# EAGLE schematic dynavo-amp (EAGLE 7.4.0)

## Sheet 1 of 2
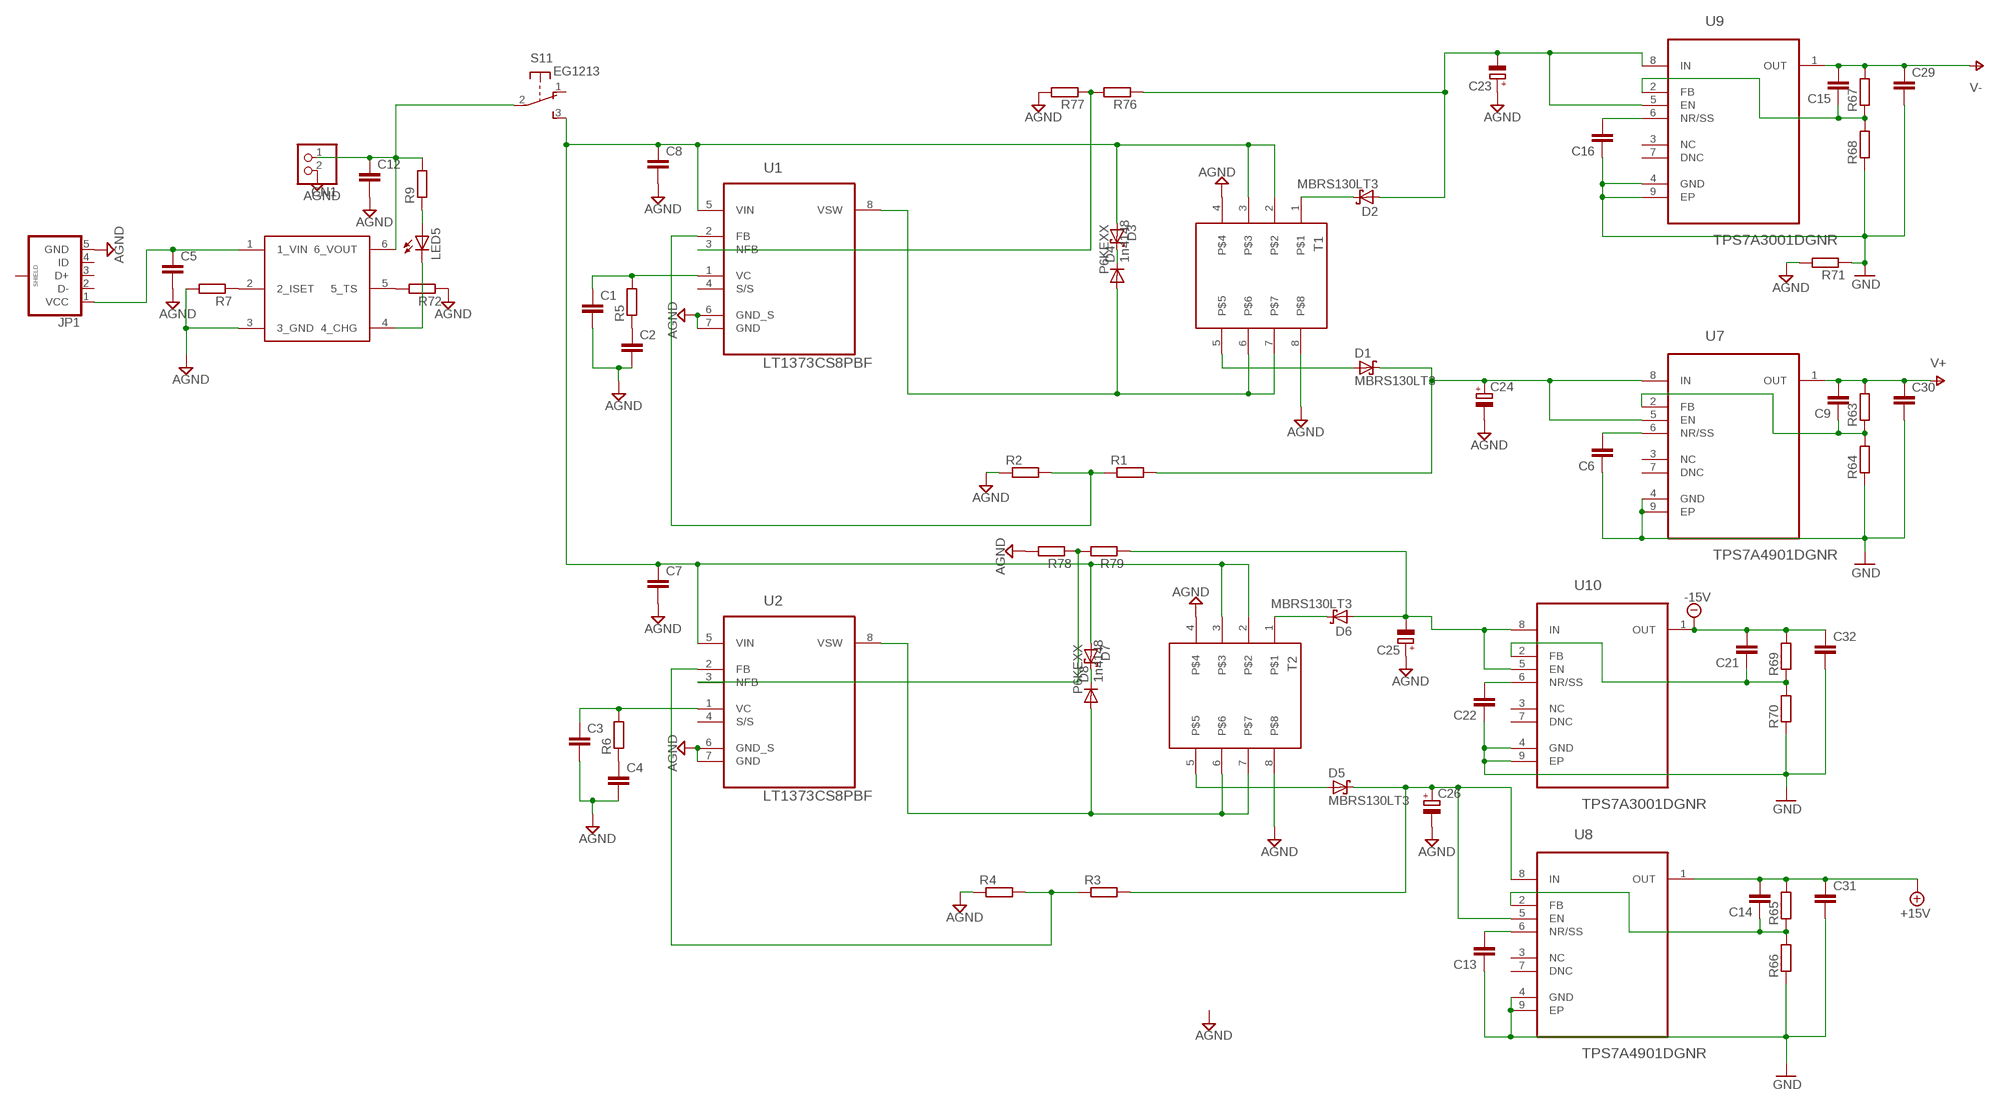
[diagram p0: schematic, sheet 1]

### Parts
C1  C-EUC1210  [C1210]
C2  C-EUC1210  [C1210]
C3  C-EUC1210  [C1210]
C4  C-EUC1210  [C1210]
C5  C-EUC1210  [C1210]
C6  C-EUC1206  [C1206]
C7  C-EUC1210  [C1210]
C8  C-EUC1210  [C1210]
C9  C-EUC1206  [C1206]
C12  C-EUC1210  [C1210]
C13  C-EUC1206  [C1206]
C14  C-EUC1206  [C1206]
C15  C-EUC1206  [C1206]
C16  C-EUC1206  [C1206]
C21  C-EUC1206  [C1206]
C22  C-EUC1206  [C1206]
C23  CPOL-EUD/7343-31W  [D/7343-31W]
C24  CPOL-EUD/7343-31W  [D/7343-31W]
C25  CPOL-EUD/7343-31W  [D/7343-31W]
C26  CPOL-EUD/7343-31W  [D/7343-31W]
C29  C-EUC1206  [C1206]
C30  C-EUC1206  [C1206]
C31  C-EUC1206  [C1206]
C32  C-EUC1206  [C1206]
CN1  JST_2PIN-THM  [JST-PH-2-THM]
D1  MBRS130LT3  [SMB]
D2  MBRS130LT3  [SMB]
D3  P6KEXX  [SMBJ]
D4  1n4148  DIODE-SOD80C  [SOD80C]
D5  MBRS130LT3  [SMB]
D6  MBRS130LT3  [SMB]
D7  P6KEXX  [SMBJ]
D8  1n4148  DIODE-SOD80C  [SOD80C]
JP1  USB_MICROB_PLUG-SMT  [MICRO-B-SMT]
LED5  LED3MM  [LED3MM]
R1  R-EU_MELF0204W  [MINI_MELF-0204W]
R2  R-EU_MELF0204W  [MINI_MELF-0204W]
R3  R-EU_MELF0204W  [MINI_MELF-0204W]
R4  R-EU_MELF0204W  [MINI_MELF-0204W]
R5  R-EU_MELF0204W  [MINI_MELF-0204W]
R6  R-EU_MELF0204W  [MINI_MELF-0204W]
R7  R-EU_MELF0204W  [MINI_MELF-0204W]
R9  R-EU_MELF0204W  [MINI_MELF-0204W]
R63  R-EU_MELF0204W  [MINI_MELF-0204W]
R64  R-EU_MELF0204W  [MINI_MELF-0204W]
R65  R-EU_MELF0204W  [MINI_MELF-0204W]
R66  R-EU_MELF0204W  [MINI_MELF-0204W]
R67  R-EU_MELF0204W  [MINI_MELF-0204W]
R68  R-EU_MELF0204W  [MINI_MELF-0204W]
R69  R-EU_MELF0204W  [MINI_MELF-0204W]
R70  R-EU_MELF0204W  [MINI_MELF-0204W]
R71  R-EU_MELF0204W  [MINI_MELF-0204W]
R72  R-EU_MELF0204W  [MINI_MELF-0204W]
R76  R-EU_MELF0204W  [MINI_MELF-0204W]
R77  R-EU_MELF0204W  [MINI_MELF-0204W]
R78  R-EU_MELF0204W  [MINI_MELF-0204W]
R79  R-EU_MELF0204W  [MINI_MELF-0204W]
S1  EG1213  [EG1213]
T1  LPE4841  [LPE4841]
T2  LPE4841  [LPE4841]
U1  LT1373CS8PBF  [SOIC127P600X175-8N]
U2  LT1373CS8PBF  [SOIC127P600X175-8N]
U3  BQ21040  [SOT-23-6]
U7  TPS7A4901DGNR  [SOP65P490X110-9N]
U8  TPS7A4901DGNR  [SOP65P490X110-9N]
U9  TPS7A3001DGNR  [SOP65P490X110-9N]
U10  TPS7A3001DGNR  [SOP65P490X110-9N]

### Nets
+15V: C14.2 C31.1 R65.2 U8.1(OUT) ; also sheet 2
-15V: C21.2 C32.1 R69.2 U10.1(OUT) ; also sheet 2
AGND: C1.2 C2.2 C3.2 C4.2 C5.2 C7.2 C8.2 C12.2 C23.+ C24.- C25.+ C26.- CN1.2 JP1.5(GND) R2.1 R4.1 R7.2 R71.2 R72.1 R77.2 R78.2 T1.4 T1.8 T2.4 T2.8 U1.6(GND_S) U1.7(GND) U2.6(GND_S) U2.7(GND) U3.3(3_GND)
GND: C6.1 C13.1 C16.1 C22.1 C29.2 C30.2 C31.2 C32.2 R64.1 R66.1 R68.1 R70.1 R71.1 U7.4(GND) U7.9(EP) U8.4(GND) U8.9(EP) U9.4(GND) U9.9(EP) U10.4(GND) U10.9(EP) ; also sheet 2
N$1: D3.C D4.C
N$2: C7.1 C8.1 D3.A D7.A S1.3(1:S) T1.2 T1.3 T2.2 T2.3 U1.5(VIN) U2.5(VIN)
N$3: D4.A T1.6 T1.7 U1.8(VSW)
N$4: D2.C T1.1
N$5: D1.A T1.5
N$6: R1.1 R2.2 U1.2(FB)
N$7: R7.1 U3.2(2_ISET)
N$8: D7.C D8.C
N$10: D8.A T2.6 T2.7 U2.8(VSW)
N$11: D6.C T2.1
N$12: D5.A T2.5
N$13: R3.1 R4.2 U2.2(FB)
N$14: C1.1 R5.2 U1.1(VC)
N$15: C3.1 R6.2 U2.1(VC)
N$16: C2.1 R5.1
N$17: C4.1 R6.1
N$21: LED5.A R9.1
N$23: C5.1 JP1.1(VCC) U3.1(1_VIN)
N$73: C24.+ D1.C R1.2 U7.5(EN) U7.8(IN)
N$74: C23.- D2.A R76.1 U9.5(EN) U9.8(IN)
N$83: C12.1 CN1.1 R9.2 S1.2(1:P) U3.6(6_VOUT)
N$84: LED5.K(C) U3.4(4_CHG)
N$87: C26.+ D5.C R3.2 U8.5(EN) U8.8(IN)
N$88: C25.- D6.A R79.1 U10.5(EN) U10.8(IN)
N$89: C9.1 R63.1 R64.2 U7.2(FB)
N$90: C14.1 R65.1 R66.2 U8.2(FB)
N$91: C15.1 R67.1 R68.2 U9.2(FB)
N$92: C16.2 U9.6(NR/SS)
N$93: C13.2 U8.6(NR/SS)
N$95: C21.1 R69.1 R70.2 U10.2(FB)
N$96: C6.2 U7.6(NR/SS)
N$98: C22.2 U10.6(NR/SS)
N$99: R72.2 U3.5(5_TS)
N$103: R76.2 R77.1 U1.3(NFB)
N$104: R78.1 R79.2 U2.3(NFB)
V+: C9.2 C30.1 R63.2 U7.1(OUT) ; also sheet 2
V-: C15.2 C29.1 R67.2 U9.1(OUT) ; also sheet 2
Unconnected: JP1.2(D-) JP1.3(D+) JP1.4(ID) JP1.P$6(SHIELD) S1.1(1:O) S1.MT1(MT) S1.MT2(MT) U1.4(S/S) U2.4(S/S) U7.3(NC) U7.7(DNC) U8.3(NC) U8.7(DNC) U9.3(NC) U9.7(DNC) U10.3(NC) U10.7(DNC)

## Sheet 2 of 2
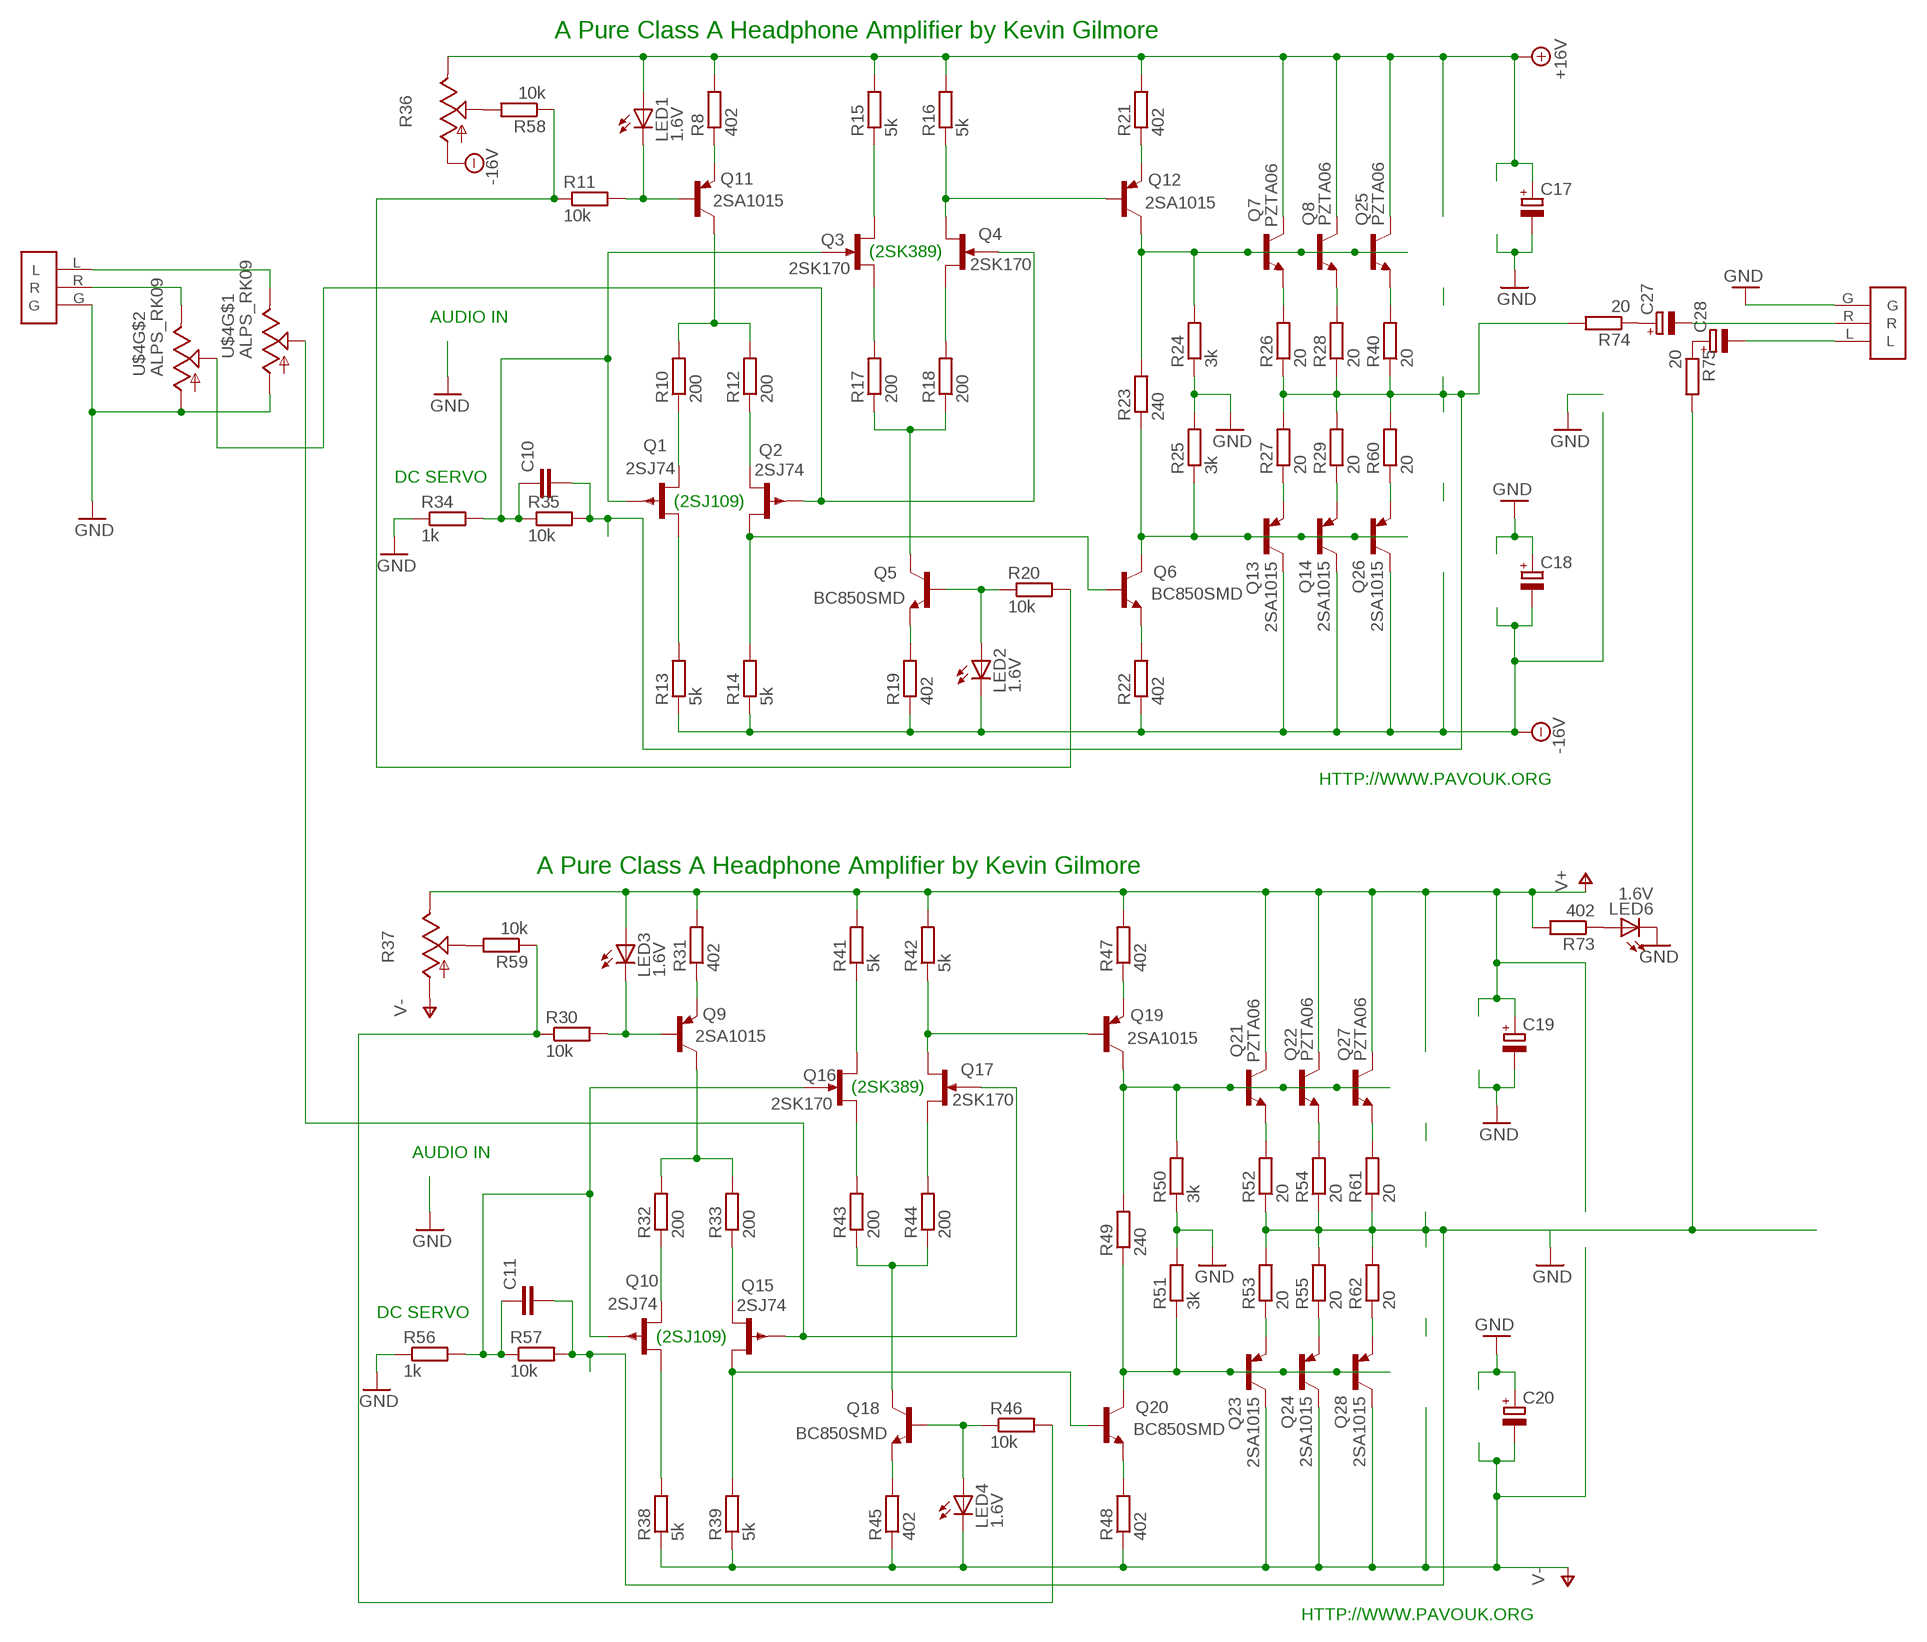
[diagram p1: schematic, sheet 2]

### Parts
C10  C-EUC1206  [C1206]
C11  C-EUC1206  [C1206]
C17  CPOL-EUD/7343-31W  [D/7343-31W]
C18  CPOL-EUD/7343-31W  [D/7343-31W]
C19  CPOL-EUD/7343-31W  [D/7343-31W]
C20  CPOL-EUD/7343-31W  [D/7343-31W]
C27  CPOL-EUD/7343-31W  [D/7343-31W]
C28  CPOL-EUD/7343-31W  [D/7343-31W]
LED1  1.6V  LEDCHIPLED_1206  [CHIPLED_1206]
LED2  1.6V  LEDCHIPLED_1206  [CHIPLED_1206]
LED3  1.6V  LEDCHIPLED_1206  [CHIPLED_1206]
LED4  1.6V  LEDCHIPLED_1206  [CHIPLED_1206]
LED6  1.6V  LEDCHIPLED_1206  [CHIPLED_1206]
Q1  2SJ74  MMBF5462  [SOT23]
Q2  2SJ74  MMBF5462  [SOT23]
Q3  2SK170  MMBFJ202  [SOT23]
Q4  2SK170  MMBFJ202  [SOT23]
Q5  BC850SMD  [SOT23-BEC]
Q6  BC850SMD  [SOT23-BEC]
Q7  PZTA06  [SOT223R_INFINEON]
Q8  PZTA06  [SOT223R_INFINEON]
Q9  2SA1015  BC860CSMD  [SOT23-BEC]
Q10  2SJ74  MMBF5462  [SOT23]
Q11  2SA1015  BC860CSMD  [SOT23-BEC]
Q12  2SA1015  BC860CSMD  [SOT23-BEC]
Q13  2SA1015  PZTA56  [SOT223R_INFINEON]
Q14  2SA1015  PZTA56  [SOT223R_INFINEON]
Q15  2SJ74  MMBF5462  [SOT23]
Q16  2SK170  MMBFJ202  [SOT23]
Q17  2SK170  MMBFJ202  [SOT23]
Q18  BC850SMD  [SOT23-BEC]
Q19  2SA1015  BC860CSMD  [SOT23-BEC]
Q20  BC850SMD  [SOT23-BEC]
Q21  PZTA06  [SOT223R_INFINEON]
Q22  PZTA06  [SOT223R_INFINEON]
Q23  2SA1015  PZTA56  [SOT223R_INFINEON]
Q24  2SA1015  PZTA56  [SOT223R_INFINEON]
Q25  PZTA06  [SOT223R_INFINEON]
Q26  2SA1015  PZTA56  [SOT223R_INFINEON]
Q27  PZTA06  [SOT223R_INFINEON]
Q28  2SA1015  PZTA56  [SOT223R_INFINEON]
R8  402  R-EU_MELF0204W  [MINI_MELF-0204W]
R10  200  R-EU_MELF0204W  [MINI_MELF-0204W]
R11  10k  R-EU_MELF0204W  [MINI_MELF-0204W]
R12  200  R-EU_MELF0204W  [MINI_MELF-0204W]
R13  5k  R-EU_MELF0204W  [MINI_MELF-0204W]
R14  5k  R-EU_MELF0204W  [MINI_MELF-0204W]
R15  5k  R-EU_MELF0204W  [MINI_MELF-0204W]
R16  5k  R-EU_MELF0204W  [MINI_MELF-0204W]
R17  200  R-EU_MELF0204W  [MINI_MELF-0204W]
R18  200  R-EU_MELF0204W  [MINI_MELF-0204W]
R19  402  R-EU_MELF0204W  [MINI_MELF-0204W]
R20  10k  R-EU_MELF0204W  [MINI_MELF-0204W]
R21  402  R-EU_MELF0204W  [MINI_MELF-0204W]
R22  402  R-EU_MELF0204W  [MINI_MELF-0204W]
R23  240  R-EU_MELF0204W  [MINI_MELF-0204W]
R24  3k  R-EU_MELF0204W  [MINI_MELF-0204W]
R25  3k  R-EU_MELF0204W  [MINI_MELF-0204W]
R26  20  R-EU_MELF0204W  [MINI_MELF-0204W]
R27  20  R-EU_MELF0204W  [MINI_MELF-0204W]
R28  20  R-EU_MELF0204W  [MINI_MELF-0204W]
R29  20  R-EU_MELF0204W  [MINI_MELF-0204W]
R30  10k  R-EU_MELF0204W  [MINI_MELF-0204W]
R31  402  R-EU_MELF0204W  [MINI_MELF-0204W]
R32  200  R-EU_MELF0204W  [MINI_MELF-0204W]
R33  200  R-EU_MELF0204W  [MINI_MELF-0204W]
R34  1k  R-EU_MELF0204W  [MINI_MELF-0204W]
R35  10k  R-EU_MELF0204W  [MINI_MELF-0204W]
R36  TRIM_US-3223G  [3223G]
R37  TRIM_US-3223G  [3223G]
R38  5k  R-EU_MELF0204W  [MINI_MELF-0204W]
R39  5k  R-EU_MELF0204W  [MINI_MELF-0204W]
R40  20  R-EU_MELF0204W  [MINI_MELF-0204W]
R41  5k  R-EU_MELF0204W  [MINI_MELF-0204W]
R42  5k  R-EU_MELF0204W  [MINI_MELF-0204W]
R43  200  R-EU_MELF0204W  [MINI_MELF-0204W]
R44  200  R-EU_MELF0204W  [MINI_MELF-0204W]
R45  402  R-EU_MELF0204W  [MINI_MELF-0204W]
R46  10k  R-EU_MELF0204W  [MINI_MELF-0204W]
R47  402  R-EU_MELF0204W  [MINI_MELF-0204W]
R48  402  R-EU_MELF0204W  [MINI_MELF-0204W]
R49  240  R-EU_MELF0204W  [MINI_MELF-0204W]
R50  3k  R-EU_MELF0204W  [MINI_MELF-0204W]
R51  3k  R-EU_MELF0204W  [MINI_MELF-0204W]
R52  20  R-EU_MELF0204W  [MINI_MELF-0204W]
R53  20  R-EU_MELF0204W  [MINI_MELF-0204W]
R54  20  R-EU_MELF0204W  [MINI_MELF-0204W]
R55  20  R-EU_MELF0204W  [MINI_MELF-0204W]
R56  1k  R-EU_MELF0204W  [MINI_MELF-0204W]
R57  10k  R-EU_MELF0204W  [MINI_MELF-0204W]
R58  10k  R-EU_MELF0204W  [MINI_MELF-0204W]
R59  10k  R-EU_MELF0204W  [MINI_MELF-0204W]
R60  20  R-EU_MELF0204W  [MINI_MELF-0204W]
R61  20  R-EU_MELF0204W  [MINI_MELF-0204W]
R62  20  R-EU_MELF0204W  [MINI_MELF-0204W]
R73  402  R-EU_MELF0204W  [MINI_MELF-0204W]
R74  20  R-EU_MELF0204W  [MINI_MELF-0204W]
R75  20  R-EU_MELF0204W  [MINI_MELF-0204W]
U$2  HPJACK  [FOXCON-PHONEJACK]
U$3  HPJACK  [FOXCON-PHONEJACK]
U$4  ALPS_RK09  [RK09]

### Nets
+15V: C17.+ LED1.A Q7.2(C) Q7.4(C) Q8.2(C) Q8.4(C) Q25.2(C) Q25.4(C) R8.2 R15.2 R16.2 R21.2 R36.3(E) ; supply symbol labelled +16V ; also sheet 1
-15V: C18.- LED2.C Q13.2(C) Q13.4(C) Q14.2(C) Q14.4(C) Q26.2(C) Q26.4(C) R13.1 R14.1 R19.1 R22.1 R36.1(A) ; supply symbol labelled -16V ; also sheet 1
GND: C17.- C18.+ C19.- C20.+ LED6.C R24.1 R25.2 R34.1 R50.1 R51.2 R56.1 U$2.G U$3.G U$4.G1 U$4.G2 ; also sheet 1
N$9: C10.2 R26.1 R27.2 R28.1 R29.2 R35.2 R40.1 R60.2 R74.2
N$18: Q7.3(E) R26.2
N$19: Q8.3(E) R28.2
N$20: Q25.3(E) R40.2
N$24: Q13.3(E) R27.1
N$25: Q14.3(E) R29.1
N$26: Q26.3(E) R60.1
N$28: Q7.1(B) Q8.1(B) Q12.C Q25.1(B) R23.2 R24.2
N$29: Q6.C Q13.1(B) Q14.1(B) Q26.1(B) R23.1 R25.1
N$30: Q12.E R21.1
N$31: Q6.E R22.2
N$32: Q5.E R19.2
N$33: LED2.A Q5.B R20.1
N$34: Q5.C R17.1 R18.1
N$35: Q4.2(S) Q12.B R16.1
N$36: Q2.1(D) Q6.B R14.2
N$37: Q11.C R10.2 R12.2
N$38: Q11.E R8.1
N$39: LED1.C Q11.B R11.2
N$40: Q2.3(G) Q4.3(G) U$4.O2
N$41: R36.2(S) R58.2
N$42: R37.2(S) R59.2
N$43: R11.1 R20.2 R58.1
N$44: C10.1 Q1.3(G) Q3.3(G) R34.2 R35.1
N$45: Q1.1(D) R10.1
N$46: Q2.2(S) R12.1
N$47: Q1.2(S) R13.2
N$48: Q3.1(D) R15.1
N$49: Q3.2(S) R17.2
N$50: Q4.1(D) R18.2
N$51: C11.2 R52.1 R53.2 R54.1 R55.2 R57.2 R61.1 R62.2 R75.2
N$52: Q21.3(E) R52.2
N$53: Q22.3(E) R54.2
N$54: Q27.3(E) R61.2
N$56: Q23.3(E) R53.1
N$57: Q24.3(E) R55.1
N$58: Q28.3(E) R62.1
N$60: Q19.C Q21.1(B) Q22.1(B) Q27.1(B) R49.2 R50.2
N$61: Q20.C Q23.1(B) Q24.1(B) Q28.1(B) R49.1 R51.1
N$62: Q19.E R47.1
N$63: Q20.E R48.2
N$64: Q18.E R45.2
N$65: LED4.A Q18.B R46.1
N$66: Q18.C R43.1 R44.1
N$67: Q17.2(S) Q19.B R42.1
N$68: Q15.1(D) Q20.B R39.2
N$69: Q9.C R32.2 R33.2
N$70: Q9.E R31.1
N$71: LED3.C Q9.B R30.2
N$72: Q15.3(G) Q17.3(G) U$4.O1
N$75: R30.1 R46.2 R59.1
N$76: C11.1 Q10.3(G) Q16.3(G) R56.2 R57.1
N$77: Q10.1(D) R32.1
N$78: Q15.2(S) R33.1
N$79: Q10.2(S) R38.2
N$80: Q16.1(D) R41.1
N$81: Q16.2(S) R43.2
N$82: Q17.1(D) R44.2
N$85: U$3.R U$4.I2
N$86: U$3.L U$4.I1
N$94: C27.- U$2.R
N$97: C28.- U$2.L
N$100: LED6.A R73.1
N$101: C27.+ R74.1
N$102: C28.+ R75.1
V+: C19.+ LED3.A Q21.2(C) Q21.4(C) Q22.2(C) Q22.4(C) Q27.2(C) Q27.4(C) R31.2 R37.3(E) R41.2 R42.2 R47.2 R73.2 ; also sheet 1
V-: C20.- LED4.C Q23.2(C) Q23.4(C) Q24.2(C) Q24.4(C) Q28.2(C) Q28.4(C) R37.1(A) R38.1 R39.1 R45.1 R48.1 ; also sheet 1

### Notes on the sheet
- A Pure Class A Headphone Amplifier by Kevin Gilmore
- (2SK389)
- AUDIO IN
- DC SERVO
- (2SJ109)
- HTTP://WWW.PAVOUK.ORG
- A Pure Class A Headphone Amplifier by Kevin Gilmore
- (2SK389)
- AUDIO IN
- DC SERVO
- (2SJ109)
- HTTP://WWW.PAVOUK.ORG

## Library data of the parts
C1-C16 C21 C22 C29-C32 = Vwvwbg:C-EU: CAPACITOR, European symbol
C17-C20 C23-C28 = Vwvwbg:CPOL-EU: POLARIZED CAPACITOR, European symbol
CN1 = adafruit:JST_2PIN: JST 2-Pin Connectors of various flavors SMT-RA (S2B-PH-SM4) 4UConnector #17311 SMT (B2B-PH-SM4) THM-RA (S2B-PH) THM (B2B-PH)
D1 D2 D5 D6 = diode:MBRS130LT3: Schottky Power Rectifier Source: http://www.onsemi.com/pub/Collateral/MBRS130LT3-D.PDF
D3 D7 = diode:P6KEXX: DIODE transient-voltage suppressor
D4 D8 = diode:DIODE-: DIODE
JP1 = SparkFun-Connectors:USB_MICROB_PLUG: USB Micro-B connectors Some male, some female. Watch your step!; PROD_ID: CONN-09900
LED1-LED6 = led:LED: LED OSRAM: - CHIPLED LG R971, LG N971, LY N971, LG Q971, LY Q971, LO R971, LY R971 LH N974, LH R974 LS Q976, LO Q976, LY Q976 LO Q996 - Hyper CHIPLED LW Q18S LB Q993, LB Q99A, LB R99A - SideLED LS A670, LO A670, LY A670, LG A670, LP A670 LB A673, LV A673, LT A673, LW A673 LH A674 LY A675 LS A676, LA A676, LO A676, LY A676, LW A676 LS A679, LY A679, LG A679 - Hyper Micro SIDELED® LS Y876, LA Y876, LO Y876, LY Y876 LT Y87S - SmartLED LW L88C, LW L88S LB L89C, LB L89S, LG L890 LS L89K, LO L89K, LY L89K LS L896, LA L896, LO L896, LY L896 - TOPLED LS T670, LO T670, LY T670, LG T670, LP T670 LSG T670, LSP T670, LSY T670, LOP T670, LYG T670 LG T671, LOG T671, LSG T671 LB T673, LV T673, LT T673, LW T673 LH T674 LS T676, LA T676, LO T676, LY T676, LB T676, LH T676, LSB T676, LW T676 LB T67C, LV T67C, LT T67C, LS T67K, LO T67K, LY T67K, LW E67C LS E67B, LA E67B, LO E67B, LY E67B, LB E67C, LV E67C, LT E67C LW T67C LS T679, LY T679, LG T679 LS T770, LO T770, LY T770, LG T770, LP T770 LB T773, LV T773, LT T773, LW T773 LH T774 LS E675, LA E675, LY E675, LS T675 LS T776, LA T776, LO T776, LY T776, LB T776 LHGB T686 LT T68C, LB T68C - Hyper Mini TOPLED® LB M676 - Mini TOPLED Santana® LG M470 LS M47K, LO M47K, LY M47K Source: http://www.osram.convergy.de LUXEON: - LUMILED® LXK2-PW12-R00, LXK2-PW12-S00, LXK2-PW14-U00, LXK2-PW14-V00 LXK2-PM12-R00, LXK2-PM12-S00, LXK2-PM14-U00 LXK2-PE12-Q00, LXK2-PE12-R00, LXK2-PE12-S00, LXK2-PE14-T00, LXK2-PE14-U00 LXK2-PB12-K00, LXK2-PB12-L00, LXK2-PB12-M00, LXK2-PB14-N00, LXK2-PB14-P00, LXK2-PB14-Q00 LXK2-PR12-L00, LXK2-PR12-M00, LXK2-PR14-Q00, LXK2-PR14-R00 LXK2-PD12-Q00, LXK2-PD12-R00, LXK2-PD12-S00 LXK2-PH12-R00, LXK2-PH12-S00 LXK2-PL12-P00, LXK2-PL12-Q00, LXK2-PL12-R00 Source: www.luxeon.com KINGBRIGHT: KA-3528ASYC Source: www.kingbright.com
Q1 Q2 Q10 Q15 = transistor-small-signal:MMBF5462
Q3 Q4 Q16 Q17 = transistor-small-signal:MMBFJ202
Q5 Q6 Q18 Q20 = tranzistory SMD NPN:BC850*: NPN Transistor
Q7 Q8 Q21 Q22 Q25 Q27 = tranzistory SMD NPN:PZTA06
Q9 Q11 Q12 Q19 = tranzistory SMD PNP:BC860*: PNP Transistror
Q13 Q14 Q23 Q24 Q26 Q28 = tranzistory SMD PNP:PZTA56
R1-R35 R38-R79 = Vwvwbg:R-EU_: RESISTOR, European symbol
R36 R37 = pot:TRIM_US-: POTENTIOMETER
S1 = adafruit:EG1213: E-Switch right-angle slide SPDT Part #EG1213 http://www.ladyada.net/library/eagle
T1 T2 = Vwvwbg:LPE4841
U1 U2 = LTC_By_element14_Batch_1:LT1373CS8PBF: 250kHz Low Supply Current 250kHz Low Supply Current 1.5A Switching Regulator; MPN: LT1373CS8#PBF; OC_FARNELL: 1273739; OC_NEWARK: 57M3629; PACKAGE: SOIC-8; SUPPLIER: Linear Technology
U3 = Vwvwbg:BQ21040
U7 U8 = Texas Instruments_By_element14_Batch_1:TPS7A4901DGNR: ?36V, ?200mA, Ultralow-Noise, Negative LINEAR REGULATOR; MPN: TPS7A4901DGNR; OC_FARNELL: -; OC_NEWARK: 01T0879; PACKAGE: MSOP-8; SUPPLIER: Texas Instruments
U9 U10 = Texas Instruments_By_element14_Batch_1:TPS7A3001DGNR: ?36V, ?200mA, Ultralow-Noise, Negative LINEAR REGULATOR; MPN: TPS7A3001DGNR; OC_FARNELL: -; OC_NEWARK: 01T0878; PACKAGE: MSOP-8; SUPPLIER: Texas Instruments
U$2 U$3 = Vwvwbg:HPJACK
U$4 = audio-pots:ALPS_RK09